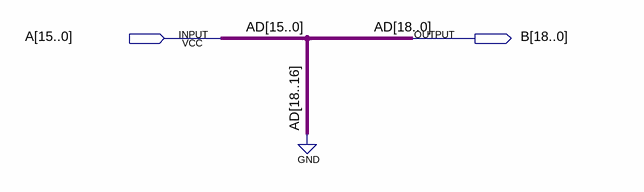
[diagram p0: schematic sheet]
// Quartus schematic L16to19B.bdf as structural Verilog: 0 symbols, 2 pins
module L16to19B (
  input  [15:0] A,
  output [18:0] B
);


  assign B = {3'b000, A};

  // Other names for the same wires on the sheet: AD[15:0] = A
endmodule
